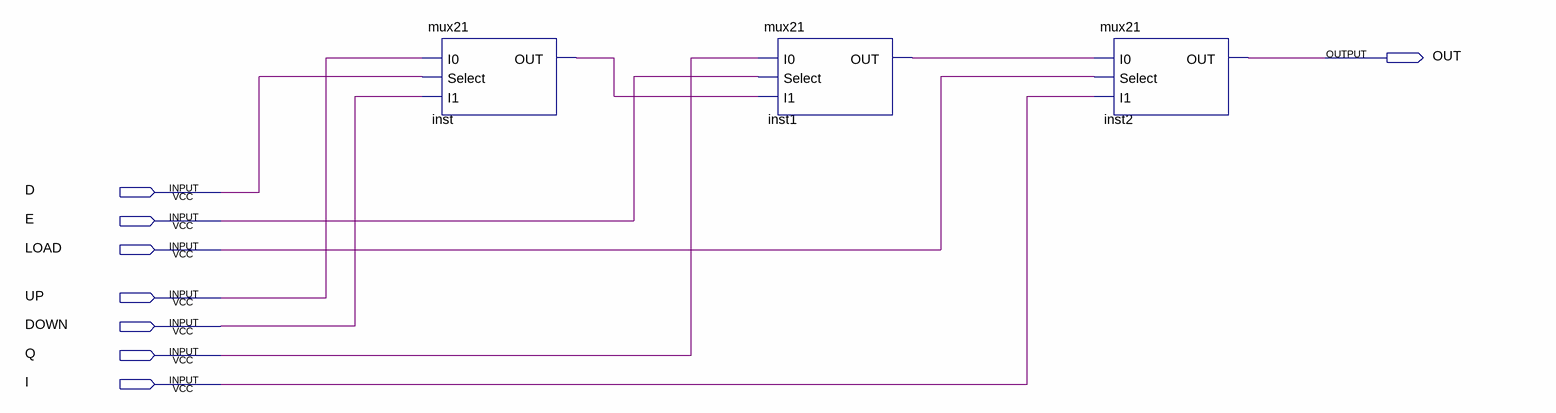
[diagram p0: schematic sheet]
// Quartus schematic SELECTOR.bdf as structural Verilog: 3 symbols, 8 pins
module SELECTOR (
  input  D,
  input  E,
  input  LOAD,
  input  UP,
  input  DOWN,
  input  Q,
  input  I,
  output OUT
);

  wire inst1_out, inst_out;

  mux21 inst (.I0(UP), .Select(D), .I1(DOWN), .OUT(inst_out));
  mux21 inst1 (.I0(Q), .Select(E), .I1(inst_out), .OUT(inst1_out));
  mux21 inst2 (.I0(inst1_out), .Select(LOAD), .I1(I), .OUT(OUT));
endmodule
